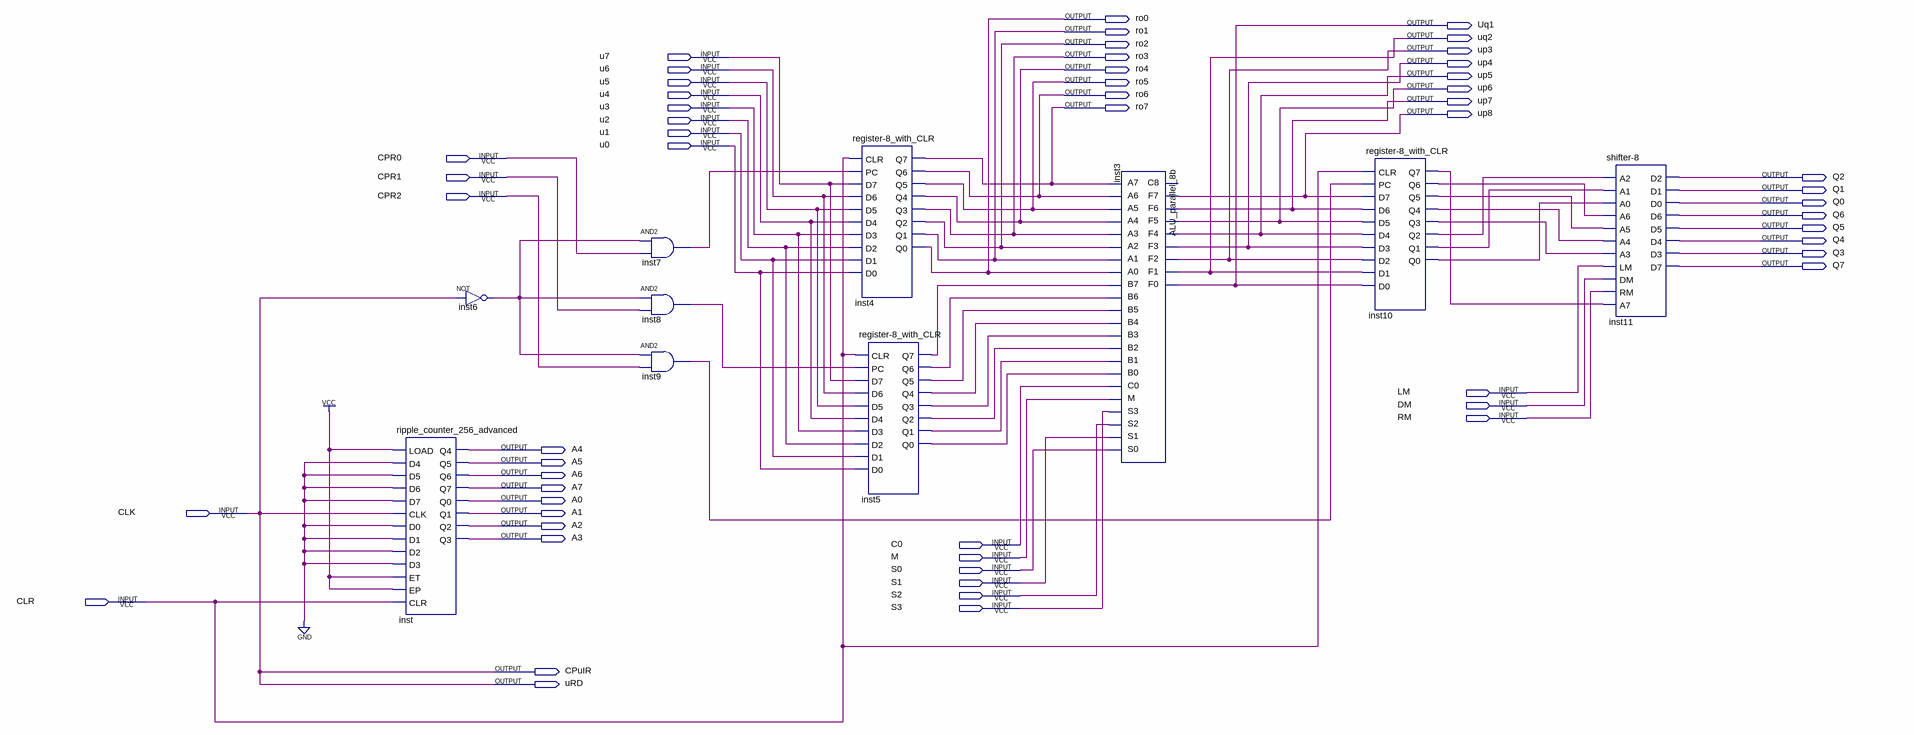
[diagram p0: schematic sheet]
// Quartus schematic microprogram_calculate.bdf as structural Verilog: 10 symbols, 56 pins
module microprogram_calculate (
  input  u7,
  input  u6,
  input  u5,
  input  u4,
  input  u3,
  input  u2,
  input  u1,
  input  u0,
  input  CPR0,
  input  CPR1,
  input  CPR2,
  input  LM,
  input  DM,
  input  RM,
  input  CLK,
  input  C0,
  input  M,
  input  S0,
  input  S1,
  input  S2,
  input  CLR,
  input  S3,
  output ro0,
  output Uq1,
  output ro1,
  output uq2,
  output ro2,
  output up3,
  output ro3,
  output up4,
  output ro4,
  output up5,
  output ro5,
  output up6,
  output ro6,
  output up7,
  output ro7,
  output up8,
  output Q2,
  output Q1,
  output Q0,
  output Q6,
  output Q5,
  output Q4,
  output Q3,
  output Q7,
  output A4,
  output A5,
  output A6,
  output A7,
  output A0,
  output A1,
  output A2,
  output A3,
  output CPuIR,
  output uRD
);

  wire inst5_q0, inst5_q1, inst5_q2, inst5_q3, inst5_q4, inst5_q5, inst5_q6, inst5_q7, inst6_out, inst7_out,
       inst8_out, inst9_out, inst10_q0, inst10_q1, inst10_q2, inst10_q3, inst10_q4, inst10_q5, inst10_q6,
       inst10_q7;

  ripple_counter_256_advanced inst (
    .LOAD(1'b1), .D4(1'b0), .D5(1'b0), .D6(1'b0), .D7(1'b0), .CLK(CLK), .D0(1'b0), .D1(1'b0), .D2(1'b0),
    .D3(1'b0), .ET(1'b1), .EP(1'b1), .CLR(CLR), .Q4(A4), .Q5(A5), .Q6(A6), .Q7(A7), .Q0(A0), .Q1(A1),
    .Q2(A2), .Q3(A3));
  not inst6 (inst6_out, CLK);
  and inst7 (inst7_out, inst6_out, CPR0);
  and inst8 (inst8_out, inst6_out, CPR1);
  and inst9 (inst9_out, inst6_out, CPR2);
  \register-8_with_CLR  inst4 (
    .CLR(CLR), .PC(inst7_out), .D7(u7), .D6(u6), .D5(u5), .D4(u4), .D3(u3), .D2(u2), .D1(u1), .D0(u0),
    .Q7(ro7), .Q6(ro6), .Q5(ro5), .Q4(ro4), .Q3(ro3), .Q2(ro2), .Q1(ro1), .Q0(ro0));
  \register-8_with_CLR  inst5 (
    .CLR(CLR), .PC(inst8_out), .D7(u7), .D6(u6), .D5(u5), .D4(u4), .D3(u3), .D2(u2), .D1(u1), .D0(u0),
    .Q7(inst5_q7), .Q6(inst5_q6), .Q5(inst5_q5), .Q4(inst5_q4), .Q3(inst5_q3), .Q2(inst5_q2), .Q1(inst5_q1),
    .Q0(inst5_q0));
  ALU_parallel_8b inst3 (
    .A0(ro0), .B0(inst5_q0), .A1(ro1), .B1(inst5_q1), .A2(ro2), .B2(inst5_q2), .A3(ro3), .B3(inst5_q3),
    .C0(C0), .M(M), .S3(S3), .S2(S2), .S1(S1), .S0(S0), .A4(ro4), .B4(inst5_q4), .A5(ro5), .B5(inst5_q5),
    .A6(ro6), .B6(inst5_q6), .A7(ro7), .B7(inst5_q7), .F0(Uq1), .F1(uq2), .F2(up3), .F3(up4), .F4(up5),
    .F5(up6), .F6(up7), .F7(up8));  // open: C8
  \register-8_with_CLR  inst10 (
    .CLR(CLR), .PC(inst9_out), .D7(up8), .D6(up7), .D5(up6), .D4(up5), .D3(up4), .D2(up3), .D1(uq2),
    .D0(Uq1), .Q7(inst10_q7), .Q6(inst10_q6), .Q5(inst10_q5), .Q4(inst10_q4), .Q3(inst10_q3), .Q2(inst10_q2),
    .Q1(inst10_q1), .Q0(inst10_q0));
  \shifter-8  inst11 (
    .A2(inst10_q2), .A1(inst10_q1), .A0(inst10_q0), .A6(inst10_q6), .A5(inst10_q5), .A4(inst10_q4),
    .A3(inst10_q3), .LM(LM), .DM(DM), .RM(RM), .A7(inst10_q7), .D2(Q2), .D1(Q1), .D0(Q0), .D6(Q6), .D5(Q5),
    .D4(Q4), .D3(Q3), .D7(Q7));

  assign CPuIR = CLK;
  assign uRD = CLK;
endmodule
